# EAGLE board MAIN_V093r3 (EAGLE 5.11), part 1 of 2
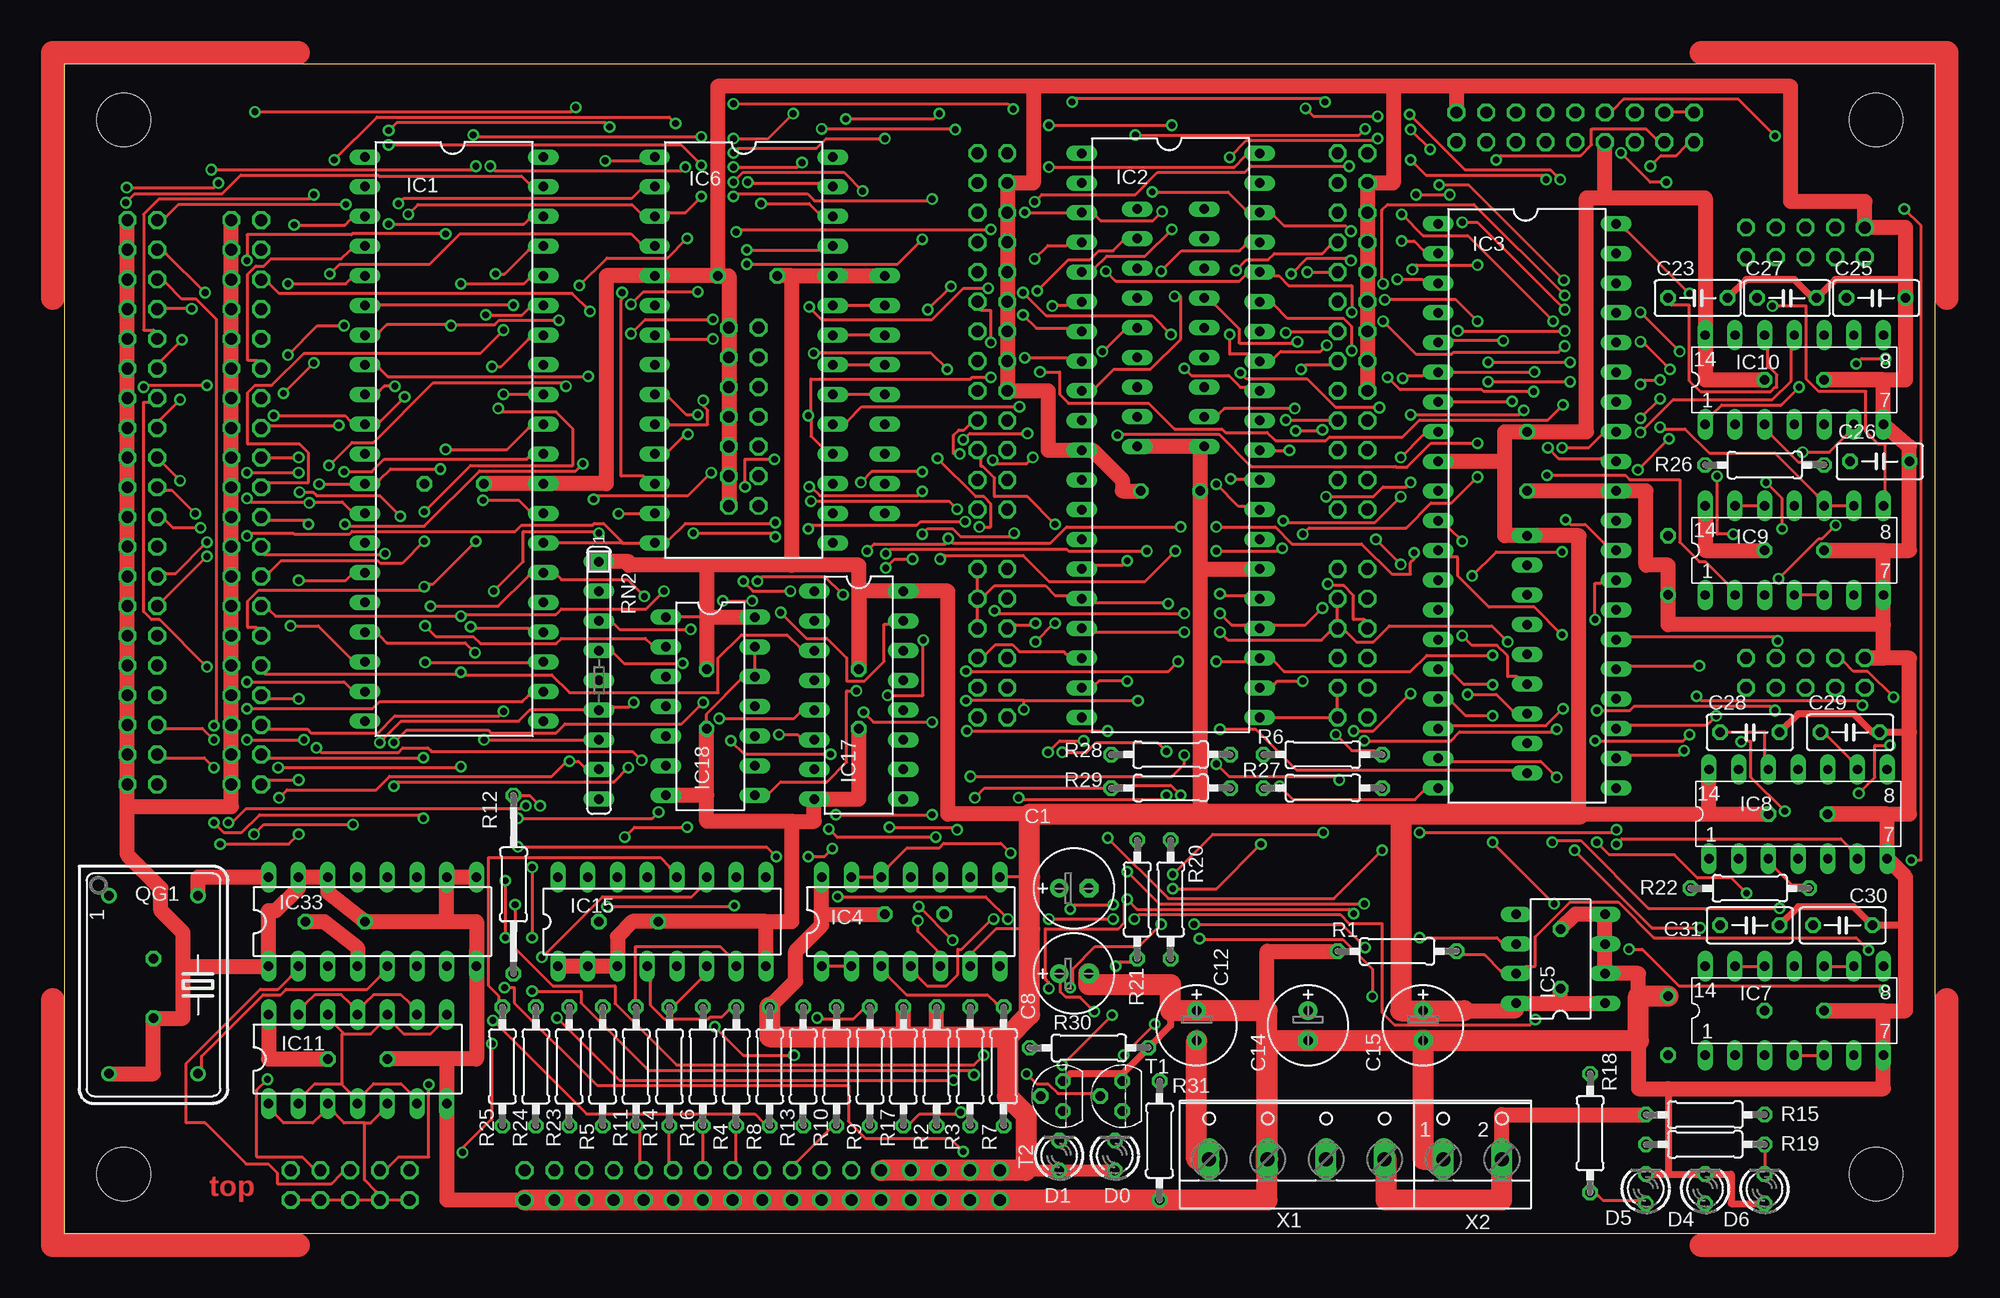
[diagram p4: board, top side]
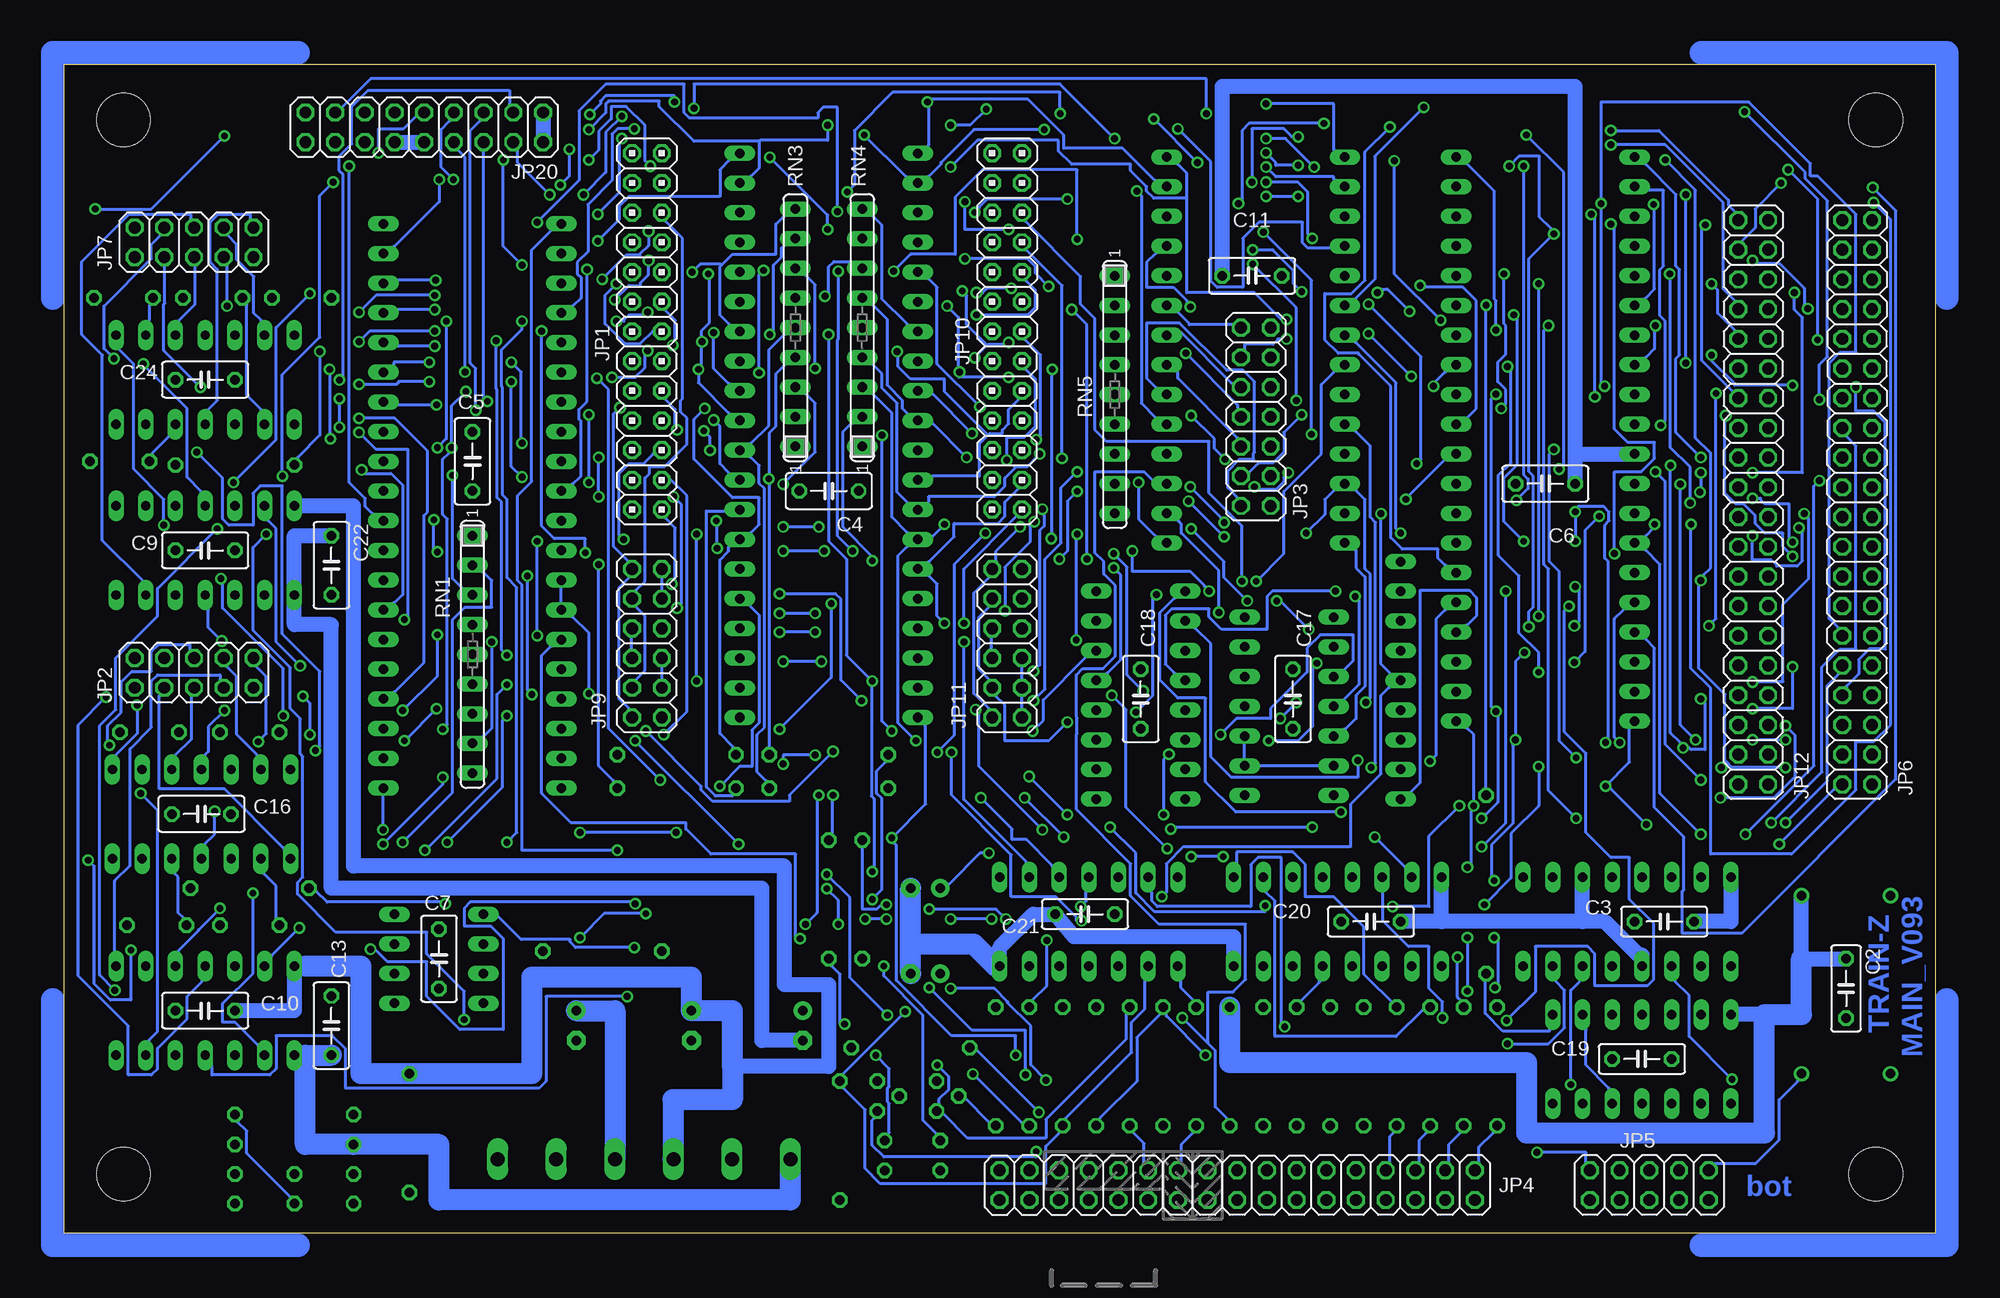
[diagram p5: board, bottom side, seen from below]

Size 160 x 100 mm. Coordinates in mm from the lower left corner, seen from the top.
Outline: 0,0 160,0 160,100 0,100 0,0
Copper layers (1*16): Top 0.035mm / dielectric 1.5mm / Bottom 0.035mm
Design rules "qprint_1": minimum track width 10mil, minimum drill 23mil, track to track 8mil, track to pad 8mil, pad to pad 8mil, via to via 8mil, smd to smd 8mil, copper to edge 40mil, drill to drill 8mil, minimum pad ring 10mil, minimum via ring 8mil, stop-mask expansion 4mil, vias tented up to drill 24mil, thermal gap 10mil
Net classes: 0 default: width 0.254 mm, clearance 0.203 mm; 1 +5V: width 1.016 mm, clearance 0.203 mm; 2 +12V: width 1.016 mm, clearance 0.203 mm; 3 -12V: width 1.016 mm, clearance 0.203 mm; 4 GND: width 1.27 mm, clearance 0.203 mm
Holes 4.57 mm at 5.08,95.25 5.08,5.08 154.94,5.08 154.94,95.25
tRestrict: area 0.3,90.8 to 10.2,99.7; area 149.9,90.8 to 159.7,99.7; area 149.9,0.3 to 159.7,9.2; area 0.3,0.3 to 10.2,9.2; 4 lines
bRestrict: area 0.3,90.8 to 10.2,99.7; area 149.9,90.8 to 159.7,99.7; area 149.9,0.3 to 159.7,9.2; area 0.3,0.3 to 10.2,9.2; 4 lines

## Footprints (pad centres in the part's own frame; a part is rotated, then mirrored left to right if it is on the bottom)
E2,5-7 = drill 0.813 pad 1.6 round: + -1.27,0 | drill 0.813 pad 1.6 octagon: - 1.27,0
C050-025X075 = drill 0.813 octagon: 1 -2.54,0; 2 2.54,0
C050-030X075 = drill 0.813 octagon: 1 -2.54,0; 2 2.54,0
LED3MM = drill 0.813 octagon: A -1.27,0; K 1.27,0
DIL40 = drill 0.813 long: 1 -24.13,-7.62; 2 -21.59,-7.62; 3 -19.05,-7.62; 4 -16.51,-7.62; 5 -13.97,-7.62; 6 -11.43,-7.62; 7 -8.89,-7.62; 8 -6.35,-7.62; 9 -3.81,-7.62; 10 -1.27,-7.62; 11 1.27,-7.62; 12 3.81,-7.62; 13 6.35,-7.62; 14 8.89,-7.62; 15 11.43,-7.62; 16 13.97,-7.62; 17 16.51,-7.62; 18 19.05,-7.62; 19 21.59,-7.62; 20 24.13,-7.62; 21 24.13,7.62; 22 21.59,7.62; 23 19.05,7.62; 24 16.51,7.62; 25 13.97,7.62; 26 11.43,7.62; 27 8.89,7.62; 28 6.35,7.62; 29 3.81,7.62; 30 1.27,7.62; 31 -1.27,7.62; 32 -3.81,7.62; 33 -6.35,7.62; 34 -8.89,7.62; 35 -11.43,7.62; 36 -13.97,7.62; 37 -16.51,7.62; 38 -19.05,7.62; 39 -21.59,7.62; 40 -24.13,7.62
DIL14 = drill 0.813 long: 1 -7.62,-3.81; 2 -5.08,-3.81; 3 -2.54,-3.81; 4 0,-3.81; 5 2.54,-3.81; 6 5.08,-3.81; 7 7.62,-3.81; 8 7.62,3.81; 9 5.08,3.81; 10 2.54,3.81; 11 0,3.81; 12 -2.54,3.81; 13 -5.08,3.81; 14 -7.62,3.81
DIL8 = drill 0.813 long: 1 -3.81,-3.81; 2 -1.27,-3.81; 3 1.27,-3.81; 4 3.81,-3.81; 5 3.81,3.81; 6 1.27,3.81; 7 -1.27,3.81; 8 -3.81,3.81
DIL28 = drill 0.813 long: 1 -16.51,-7.62; 2 -13.97,-7.62; 3 -11.43,-7.62; 4 -8.89,-7.62; 5 -6.35,-7.62; 6 -3.81,-7.62; 7 -1.27,-7.62; 8 1.27,-7.62; 9 3.81,-7.62; 10 6.35,-7.62; 11 8.89,-7.62; 12 11.43,-7.62; 13 13.97,-7.62; 14 16.51,-7.62; 15 16.51,7.62; 16 13.97,7.62; 17 11.43,7.62; 18 8.89,7.62; 19 6.35,7.62; 20 3.81,7.62; 21 1.27,7.62; 22 -1.27,7.62; 23 -3.81,7.62; 24 -6.35,7.62; 25 -8.89,7.62; 26 -11.43,7.62; 27 -13.97,7.62; 28 -16.51,7.62
DIL14' = drill 0.8 long: 1 -7.62,-3.81; 2 -5.08,-3.81; 3 -2.54,-3.81; 4 0,-3.81; 5 2.54,-3.81; 6 5.08,-3.81; 7 7.62,-3.81; 8 7.62,3.81; 9 5.08,3.81; 10 2.54,3.81; 11 0,3.81; 12 -2.54,3.81; 13 -5.08,3.81; 14 -7.62,3.81
DIL16 = drill 0.813 long: 1 -8.89,-3.81; 2 -6.35,-3.81; 3 -3.81,-3.81; 4 -1.27,-3.81; 5 1.27,-3.81; 6 3.81,-3.81; 7 6.35,-3.81; 8 8.89,-3.81; 9 8.89,3.81; 10 6.35,3.81; 11 3.81,3.81; 12 1.27,3.81; 13 -1.27,3.81; 14 -3.81,3.81; 15 -6.35,3.81; 16 -8.89,3.81
2X13 = drill 1.016 octagon: 1 -15.24,-1.27; 2 -15.24,1.27; 3 -12.7,-1.27; 4 -12.7,1.27; 5 -10.16,-1.27; 6 -10.16,1.27; 7 -7.62,-1.27; 8 -7.62,1.27; 9 -5.08,-1.27; 10 -5.08,1.27; 11 -2.54,-1.27; 12 -2.54,1.27; 13 0,-1.27; 14 0,1.27; 15 2.54,-1.27; 16 2.54,1.27; 17 5.08,-1.27; 18 5.08,1.27; 19 7.62,-1.27; 20 7.62,1.27; 21 10.16,-1.27; 22 10.16,1.27; 23 12.7,-1.27; 24 12.7,1.27; 25 15.24,-1.27; 26 15.24,1.27
2X05 = drill 1.016 octagon: 1 -5.08,-1.27; 2 -5.08,1.27; 3 -2.54,-1.27; 4 -2.54,1.27; 5 0,-1.27; 6 0,1.27; 7 2.54,-1.27; 8 2.54,1.27; 9 5.08,-1.27; 10 5.08,1.27
2X07 = drill 1.016 octagon: 1 -7.62,-1.27; 2 -7.62,1.27; 3 -5.08,-1.27; 4 -5.08,1.27; 5 -2.54,-1.27; 6 -2.54,1.27; 7 0,-1.27; 8 0,1.27; 9 2.54,-1.27; 10 2.54,1.27; 11 5.08,-1.27; 12 5.08,1.27; 13 7.62,-1.27; 14 7.62,1.27
2X17 = drill 1.016 octagon: 1 -20.32,-1.27; 2 -20.32,1.27; 3 -17.78,-1.27; 4 -17.78,1.27; 5 -15.24,-1.27; 6 -15.24,1.27; 7 -12.7,-1.27; 8 -12.7,1.27; 9 -10.16,-1.27; 10 -10.16,1.27; 11 -7.62,-1.27; 12 -7.62,1.27; 13 -5.08,-1.27; 14 -5.08,1.27; 15 -2.54,-1.27; 16 -2.54,1.27; 17 0,-1.27; 18 0,1.27; 19 2.54,-1.27; 20 2.54,1.27; 21 5.08,-1.27; 22 5.08,1.27; 23 7.62,-1.27; 24 7.62,1.27; 25 10.16,-1.27; 26 10.16,1.27; 27 12.7,-1.27; 28 12.7,1.27; 29 15.24,-1.27; 30 15.24,1.27; 31 17.78,-1.27; 32 17.78,1.27; 33 20.32,-1.27; 34 20.32,1.27
2X20 = drill 1.016 octagon: 1 -24.13,-1.27; 2 -24.13,1.27; 3 -21.59,-1.27; 4 -21.59,1.27; 5 -19.05,-1.27; 6 -19.05,1.27; 7 -16.51,-1.27; 8 -16.51,1.27; 9 -13.97,-1.27; 10 -13.97,1.27; 11 -11.43,-1.27; 12 -11.43,1.27; 13 -8.89,-1.27; 14 -8.89,1.27; 15 -6.35,-1.27; 16 -6.35,1.27; 17 -3.81,-1.27; 18 -3.81,1.27; 19 -1.27,-1.27; 20 -1.27,1.27; 21 1.27,-1.27; 22 1.27,1.27; 23 3.81,-1.27; 24 3.81,1.27; 25 6.35,-1.27; 26 6.35,1.27; 27 8.89,-1.27; 28 8.89,1.27; 29 11.43,-1.27; 30 11.43,1.27; 31 13.97,-1.27; 32 13.97,1.27; 33 16.51,-1.27; 34 16.51,1.27; 35 19.05,-1.27; 36 19.05,1.27; 37 21.59,-1.27; 38 21.59,1.27; 39 24.13,-1.27; 40 24.13,1.27
2X06 = drill 1.016 octagon: 1 -6.35,-1.27; 2 -6.35,1.27; 3 -3.81,-1.27; 4 -3.81,1.27; 5 -1.27,-1.27; 6 -1.27,1.27; 7 1.27,-1.27; 8 1.27,1.27; 9 3.81,-1.27; 10 3.81,1.27; 11 6.35,-1.27; 12 6.35,1.27
2X09 = drill 1.016 octagon: 1 -10.16,-1.27; 2 -10.16,1.27; 3 -7.62,-1.27; 4 -7.62,1.27; 5 -5.08,-1.27; 6 -5.08,1.27; 7 -2.54,-1.27; 8 -2.54,1.27; 9 0,-1.27; 10 0,1.27; 11 2.54,-1.27; 12 2.54,1.27; 13 5.08,-1.27; 14 5.08,1.27; 15 7.62,-1.27; 16 7.62,1.27; 17 10.16,-1.27; 18 10.16,1.27
DIL14S = drill 0.813 round: 1 -7.62,-3.81; 7 7.62,-3.81; 8 7.62,3.81; 14 -7.62,3.81
0207/10 = drill 0.813 octagon: 1 -5.08,0; 2 5.08,0
0207/15 = drill 0.813 octagon: 1 -7.62,0; 2 7.62,0
SIL9 = drill 0.813 long: 1 -10.16,0; 2 -7.62,0; 3 -5.08,0; 4 -2.54,0; 5 0,0; 6 2.54,0; 7 5.08,0; 8 7.62,0; 9 10.16,0
TO92 = drill 0.813 octagon: 1 1.27,0; 2 0,1.905; 3 -1.27,0
W237-4 = drill 1.194 long: 1 -7.5,-1.27; 2 -2.5,-1.27; 3 2.5,-1.27; 4 7.5,-1.27
W237-102 = drill 1.194 long: 1 -2.5,-1.27; 2 2.5,-1.27

## Placement (x,y rotation side)
C1  10µ/10V  [E2,5-7]  86.36,29.53 0 top
C2  100n  [C050-025X075]  7.62,20.95 270 bottom
C3  100n  [C050-025X075]  23.18,26.67 180 bottom
C4  100n  [C050-030X075]  94.61,63.5 180 bottom
C5  100n  [C050-030X075]  125.09,66.04 270 bottom
C6  100n  [C050-030X075]  33.34,64.14 0 bottom
C7  100n  [C050-030X075]  127.95,23.5 90 bottom
C8  100µ/10V  [E2,5-7]  86.36,22.23 0 top
C9  100n  [C050-030X075]  147.96,58.42 180 bottom
C10  100n  [C050-030X075]  147.96,19.05 180 bottom
C11  100n  [C050-030X075]  58.42,81.92 0 bottom
C12  100µ/25V  [E2,5-7]  96.84,17.78 270 top
C13  100n  [C050-030X075]  137.16,17.78 90 bottom
C14  100µ/25V  [E2,5-7]  106.36,17.78 270 top
C15  100µ/25V  [E2,5-7]  116.2,17.78 270 top
C16  100n  [C050-030X075]  148.27,35.88 180 bottom
C17  100n  [C050-030X075]  54.93,45.72 270 bottom
C18  100n  [C050-030X075]  67.94,45.72 270 bottom
C19  100n  [C050-025X075]  25.08,14.92 180 bottom
C20  100n  [C050-025X075]  48.26,26.67 180 bottom
C21  100n  [C050-025X075]  72.71,27.3 180 bottom
C22  100n  [C050-030X075]  137.16,57.15 270 bottom
C23  470p  [C050-030X075]  139.7,80.01 0 top
C24  100n  [C050-030X075]  147.96,73.03 180 bottom
C25  470p  [C050-030X075]  154.94,80.01 0 top
C26  470p  [C050-030X075]  155.26,66.04 0 top
C27  470p  [C050-030X075]  147.32,80.01 0 top
C28  470p  [C050-030X075]  144.15,42.86 0 top
C29  470p  [C050-030X075]  152.72,42.86 0 top
C30  470p  [C050-030X075]  152.08,26.35 0 top
C31  470p  [C050-030X075]  144.15,26.35 0 top
D0  [LED3MM]  89.85,6.67 90 top
D1  [LED3MM]  85.09,6.67 90 top
D4  [LED3MM]  140.34,3.81 90 top
D5  [LED3MM]  135.25,3.81 90 top
D6  [LED3MM]  145.41,3.81 90 top
IC1  Z80_CPU  [DIL40]  33.34,67.94 270 top
IC2  Z80_PIO  [DIL40]  94.61,68.26 270 top
IC3  Z80_SIO  [DIL40]  125.09,62.23 270 top
IC4  4093N  [DIL14]  72.39,26.67 0 top
IC5  24C08P  [DIL8]  127.95,23.5 90 top
IC6  Z80_CTC  [DIL28]  58.1,75.56 270 top
IC7  1488N  [DIL14']  147.96,19.05 0 top
IC8  1489N  [DIL14']  148.27,35.88 0 top
IC9  1488N  [DIL14']  147.96,58.42 0 top
IC10  1489N  [DIL14']  147.96,73.03 0 top
IC11  74LS04  [DIL14]  25.08,14.92 0 top
IC15  PCF8574P  [DIL16]  51.12,26.67 0 top
IC17  74LS138  [DIL16]  67.94,46.04 270 top
IC18  74LS00N  [DIL14]  55.24,45.09 270 top
IC33  74LS193  [DIL16]  26.35,26.67 0 top
JP1  PIO_B  [2X13]  110.17,77.15 90 bottom
JP2  SIO A  [2X05]  148.91,47.94 180 bottom
JP3  CTC_I/O  [2X07]  58.1,69.85 270 bottom
JP4  DSKY  [2X17]  59.69,4.13 180 bottom
JP5  CLK select  [2X05]  24.45,4.13 180 bottom
JP6  EXT_CTRL&DATA  [2X20]  6.67,62.55 90 bottom
JP7  SIO B  [2X05]  148.91,84.77 180 bottom
JP9  PIO_B_CONF  [2X06]  110.17,50.48 90 bottom
JP10  PIO_A  [2X13]  79.38,77.15 90 bottom
JP11  PIO_A_CONF  [2X06]  79.38,50.48 90 bottom
JP12  EXT_CTRL&ADDR  [2X20]  15.56,62.55 90 bottom
JP20  conf INT & SIO  [2X09]  129.22,94.61 180 bottom
QG1  10Mhz  [DIL14S]  7.62,21.27 270 top
R1  2k7  [0207/10]  113.98,24.13 0 top
R2  10k  [0207/10]  74.61,14.29 270 top
R3  2k7  [0207/10]  77.47,14.29 90 top
R4  160  [0207/10]  57.47,14.29 270 top
R5  160  [0207/10]  46.04,14.29 270 top
R6  160  [0207/10]  107.63,40.96 0 top
R7  2k7  [0207/10]  80.33,14.29 90 top
R8  160  [0207/10]  60.33,14.29 270 top
R9  160  [0207/10]  68.9,14.29 270 top
R10  160  [0207/10]  66.04,14.29 270 top
R11  160  [0207/10]  48.9,14.29 270 top
R12  22  [0207/15]  38.42,29.84 90 top
R13  160  [0207/10]  63.18,14.29 270 top
R14  160  [0207/10]  51.75,14.29 270 top
R15  160  [0207/10]  140.34,10.16 180 top
R16  160  [0207/10]  54.61,14.29 270 top
R17  10k  [0207/10]  71.75,14.29 270 top
R18  680  [0207/10]  130.49,8.57 90 top
R19  680  [0207/10]  140.34,7.62 180 top
R20  680  [0207/10]  94.61,28.57 270 top
R21  680  [0207/10]  91.76,28.57 270 top
R22  160  [0207/10]  144.15,29.53 180 top
R23  160  [0207/10]  43.18,14.29 270 top
R24  160  [0207/10]  40.32,14.29 270 top
R25  160  [0207/10]  37.47,14.29 270 top
R26  160  [0207/10]  145.41,65.72 180 top
R27  160  [0207/10]  107.63,38.1 0 top
R28  160  [0207/10]  94.61,40.96 180 top
R29  160  [0207/10]  94.61,38.1 180 top
R30  100k  [0207/10]  87.63,15.88 0 top
R31  100k  [0207/10]  93.66,7.94 270 top
RN1  8x10k  [SIL9]  125.09,49.53 270 bottom
RN2  8x10k  [SIL9]  45.72,47.31 270 top
RN3  8x10k  [SIL9]  97.47,77.47 90 bottom
RN4  8x10k  [SIL9]  91.76,77.47 90 bottom
RN5  8x10k  [SIL9]  70.17,71.75 270 bottom
T1  BC548C  [TO92]  90.49,11.75 90 top
T2  BC548C  [TO92]  85.41,11.75 90 top
U$1  [A4L-LOC]  -13.34,-52.7 0 top  (outside the outline)
X1  [W237-4]  105.41,7.62 0 top
X2  [W237-102]  120.43,7.62 0 top

## Tracks (layer width: path | path; a pad name or v marks a point on that pad's centre or on a via)
+5V
  Top 0.254: 54.93,52.7 IC18.1 | 82.55,30.48 IC4.8 | IC4.6 77.47,23.81 79.69,26.04 82.55,26.04
  Top 1.016: 82.23,5.4 D1.A D0.A
  Top 1.27: X2.2 122.93,10.16 R15.2 | 127.95,19.68 C7.1 | 127.95,19.68 IC5.8 124.14,19.05 119.7,19.05 | 140.65,35.88 C16.1 | 140.65,35.88 IC8.14 | 140.65,35.88 129.54,35.88 129.54,59.69 RN1.1 123.19,59.69 123.19,66.04 | 97.16,56.83 97.16,35.88 75.56,35.88 75.56,54.93 IC17.16 67.94,54.93 C18.1 67.94,57.15 | 97.16,56.83 C4.2 97.16,66.99 RN3.1 RN4.1 | 97.16,56.83 IC2.26 | 123.19,66.04 123.19,68.58 C5.1 130.18,68.58 130.18,88.58 131.76,88.58 | 123.19,66.04 IC3.9 | C24.1 140.34,73.03 IC10.14 140.34,88.58 131.76,88.58 | 62.23,81.92 C11.1 | 62.23,81.92 IC6.24 RN5.1 | 67.94,57.15 62.23,57.15 62.23,81.92 | IC33.16 11.43,30.48 QG1.14 | C3.1 22.23,26.67 25.08,24.45 IC33.4 | IC11.14 17.46,14.92 C19.1 | RN2.1 48.26,57.47 48.26,57.15 54.93,57.15 | 67.94,57.15 54.93,57.15 | 64.77,27.3 C21.1 | 64.77,27.3 IC4.14 | 64.77,27.3 64.77,26.35 62.55,24.13 62.55,21.59 R8.1 | 127.95,19.68 IC5.1 | 54.93,52.7 IC18.14 | 54.93,52.7 C17.1 | 54.93,57.15 54.93,52.7 | 71.75,16.83 R17.1 | 74.61,16.83 R2.1 | 131.76,88.58 JP20.12
  Top 1.778: 119.7,19.05 C15.+ 114.3,19.05 114.3,35.88 | X2.2 122.93,2.86 113.03,2.86 113.03,6.35 X1.4 | 114.3,35.88 129.54,35.88 | 114.3,35.88 97.16,35.88 82.55,35.88 82.55,30.48 82.55,26.04 82.55,18.73 80.64,16.83 | 80.64,16.83 80.64,11.75 82.23,10.16 82.23,5.4 JP4.33 JP4.31 JP4.29 JP4.27 JP4.25 | 80.64,16.83 74.61,16.83 71.75,16.83 60.33,16.83 R8.1
  Bottom 1.27: 30.8,66.67 IC1.11 | 30.16,26.67 42.23,26.67 | 42.23,26.67 IC15.16 | 42.23,26.67 C20.1 | C2.1 11.43,23.5 QG1.14 | C3.1 17.46,26.67 IC33.16 | 30.16,26.67 IC33.11 | 30.16,26.67 28.26,26.67 25.4,23.81 25.08,23.81 IC33.4 | 14.61,18.73 IC11.14 | 30.8,66.67 30.8,98.11 60.96,98.11 C11.1 | 30.8,66.67 C6.2 | JP20.12 JP20.10
  Bottom 1.778: X1.4 112.91,19.05 C15.+ | 11.43,23.5 11.43,18.73 14.61,18.73 14.61,8.57 34.92,8.57 34.92,14.61 60.33,14.61 R8.1
+12V
  Top 1.27: IC9.14 140.34,58.42 C9.1
  Bottom 1.27: 139.38,22.86 IC7.14 140.34,19.05 C10.1 | IC9.14 135.25,62.23 135.25,31.43 98.42,31.43 98.42,21.27 94.61,21.27 94.61,14.29 102.87,14.29
  Bottom 1.778: X1.3 107.95,6.35 107.95,11.43 102.87,11.43 102.87,14.29 102.87,19.05 C14.+ 106.36,21.91 120.02,21.91 120.02,13.65 R18.2 134.62,13.65 134.62,22.86 139.38,22.86
-12V
  Top 1.778: X1.1 96.84,6.35 C12.-
  Bottom 1.27: C13.1 IC7.1 | C22.1 140.34,59.69 IC9.1 140.34,52.07 137.16,52.07 137.16,29.53 100.33,29.53 100.33,16.51 C12.-
  Bottom 1.778: X1.1 97.91,2.86 127.95,2.86 127.95,7.62 R19.2 139.38,7.62 139.38,15.24 C13.1
/A5  (via drill 0.58)
  Top 0.254: v61.11,42.67 62.71,42.67 62.87,42.52 IC17.6
  Bottom 0.254: v61.11,42.67 59.74,44.04 56.84,44.04 56.84,44.88 53.72,48.01 53.72,50.06 52.58,51.21 49.76,51.21 49.76,49 50.52,48.23 IC18.3
/CPU_BUSAK  (via drill 0.58)
  Top 0.254: v30.86,48.84 39.7,48.84 IC1.23 | v28.73,61.34 26.98,63.09 21.57,63.09 21.26,63.4 v20.12,63.4 | v15.62,65.08 v20.04,65.08 | v12.04,80.47 8.69,83.82 JP6.38
  Bottom 0.254: v30.86,48.84 29.95,49.76 29.95,60.12 v28.73,61.34 | v20.12,63.4 20.04,63.48 v20.04,65.08 | v15.62,65.08 11.35,65.08 11.35,78.33 12.04,79.02 v12.04,80.47
/CPU_BUSREQ  (via drill 0.58)
  Top 0.254: RN2.8 44.42,39.93 43.97,40.39 v43.2,40.39 42.75,40.16 41.68,39.09 27.81,39.09 26.67,37.95 19.05,37.95 v18.36,37.26 | v12.8,43.43 13.03,43.43 13.03,78.18 11.28,79.93 10.06,79.93 8.69,81.31 JP6.36
  Bottom 0.254: v43.2,40.39 42.67,40.92 42.67,52.58 41.91,53.34 IC1.25 | v12.8,43.43 11.96,42.6 11.96,39.09 13.79,37.26 v18.36,37.26
/CPU_HALT  (via drill 0.58)
  Top 0.254: v19.36,51.97 21.72,51.97 24.46,49.23 IC1.18 | v18.75,71.86 v21.34,74.45 | v21.34,88.85 20.95,88.47 8.08,88.47 6.78,87.17 6.78,77.27 7.62,77.27 JP6.32
  Bottom 0.254: v19.36,51.97 18.75,52.58 v18.75,71.86 | v21.34,74.45 v21.34,88.85
/CPU_INT  (via drill 0.58)
  Top 0.254: v122.15,49.45 116.51,49.45 115.14,48.08 104.32,48.08 103.48,48.92 IC2.23 100.97,48.92 v98.53,48.92 | v123.06,76.35 118.72,76.35 IC3.5 | v26.98,41.99 28.8,43.81 38.86,43.81 39.85,44.81 44.42,44.81 RN2.6 47.02,45.03 48.31,45.03 v48.69,45.41 | v44.96,78.87 43.43,80.39 18.36,80.39 17.53,81.23 JP12.36 | v47.7,80.47 47.7,79.93 47.62,79.86 47.62,64.77 49.53,64.77 IC6.12 | v95.25,48.92 94.41,48.08 v77.11,48.08 | v76.35,61.95 75.67,62.64 v63.86,62.64 | v60.81,59.59 60.5,59.89 v53.8,59.89
  Bottom 0.254: v122.15,49.45 122.61,49.91 122.61,62.56 122.99,62.94 122.99,72.16 123.06,72.24 v123.06,76.35 | v26.98,41.99 27.43,42.44 27.43,52.58 26.67,53.34 IC1.16 | v48.69,45.41 48.31,45.8 48.31,56.39 48.77,56.84 48.77,62.79 49.53,63.55 IC6.12 51.44,63.55 52.2,62.79 52.2,61.49 v53.8,59.89 | v44.96,78.87 46.86,80.77 47.7,80.77 v47.7,80.47 | v95.25,48.92 v98.53,48.92 | v77.11,48.08 76.58,48.62 76.58,60.12 76.2,60.5 76.2,61.8 v76.35,61.95 | v60.81,59.59 v63.86,62.64
/CPU_IOREQ  (via drill 0.58)
  Top 0.254: v128.32,75.89 127.79,75.36 118.8,75.36 118.64,75.21 115.59,75.21 v112.78,78.03 | v110.11,78.79 110.11,81.08 104.7,81.08 103.86,81.92 103.48,81.92 IC2.36 100.97,81.92 100.51,81.46 89.92,81.46 v89.08,82.3 | v28.19,38.25 28.57,38.63 47.02,38.63 v48.23,39.85 | v16.23,34.14 17.07,34.98 v24.69,34.98 | v9.91,64.39 JP6.24 | v73.38,85.04 71.25,82.91 v58.37,82.91 | v54.63,71.25 54.63,70.79 55.02,70.41 55.02,69.19 51.74,69.19 IC6.10
  Bottom 0.254: v128.32,75.89 131.44,75.89 IC3.36 | v112.78,78.03 112.17,78.03 112.17,78.11 111.71,78.56 110.11,78.56 v110.11,78.79 | v48.23,39.85 47.85,40.23 47.85,60.81 48.31,61.27 48.31,67.36 49.53,68.58 IC6.10 | IC1.20 26.14,43.2 26.14,40.31 v28.19,38.25 27.74,38.02 v24.69,34.98 | v9.91,64.39 10.36,63.93 10.36,40.01 v16.23,34.14 | v89.08,82.3 87.63,83.74 83.82,83.74 83.82,88.62 81.46,90.98 73.38,90.98 v73.38,85.04 | v58.37,82.91 54.63,79.17 v54.63,71.25
/CPU_M1  (via drill 0.58)
  Top 0.254: 47.7,59.05 IC1.27 | 47.7,59.05 IC6.14 51.74,59.36 53.11,60.73 60.73,60.73 v60.81,60.81 | v114.3,66.37 116.2,68.28 IC3.8 | v114.3,63.02 112.09,60.81 104.39,60.81 v104.24,60.96 | v104.17,58.6 103.94,58.37 v98.53,58.37 | v95.02,58.37 92.43,55.78 84.2,55.78 81.99,57.99 75.21,57.99 v74.91,57.68 | v73.38,63.48 73,63.09 64.62,63.09 63.86,63.86 v63.7,63.86 | v11.66,60.35 9.3,60.35 8.69,60.96 JP6.20 | v15.62,59.66 15.85,59.89 19.58,59.89 19.66,59.82 24.38,59.82 24.61,60.05 38.56,60.05 39.09,60.58 45.19,60.58 45.34,60.73 46.1,60.73 47.7,59.13 47.7,59.05
  Bottom 0.254: IC18.5 50.44,43.13 49.53,44.04 49.53,46.02 48.77,46.79 48.77,56.16 49.53,56.92 49.53,58.45 IC6.14 | v114.3,63.02 v114.3,66.37 | v104.24,60.96 104.17,60.88 v104.17,58.6 | v95.02,58.37 v98.53,58.37 | v74.91,57.68 74.22,58.37 74.22,62.64 v73.38,63.48 | v63.7,63.86 60.81,60.96 v60.81,60.81 | v11.66,60.35 11.35,60.05 11.35,57.53 11.81,57.07 13.56,57.07 13.56,57.15 14.02,57.61 15.62,57.61 v15.62,59.66
/CPU_MREQ  (via drill 0.58)
  Top 0.254: v15.62,47.17 23.93,47.17 24.46,46.63 IC1.19 | v11.2,61.57 9.22,63.55 8.69,63.55 JP6.22
  Bottom 0.254: v15.62,47.17 13.03,47.17 13.03,53.8 10.82,56.01 10.82,61.19 v11.2,61.57
/CPU_NMI  (via drill 0.58)
  Top 0.254: v35.13,49.68 34.29,50.52 27.58,50.52 26.98,51.13 IC1.17 | v35.89,42.22 44.42,42.22 RN2.7 | v76.89,7.01 75.74,8.15 68.5,8.15 67.06,9.6 67.06,12.65 45.57,12.65 38.48,19.74 38.48,21.03 v37.64,21.03 | v37.72,30.18 v37.72,25.3 | v13.18,89.84 12.8,89.46 v5.33,89.46
  Bottom 0.254: v35.13,49.68 35.89,48.92 v35.89,42.22 36.12,41.76 36.12,35.05 37.95,33.22 37.95,30.4 v37.72,30.18 | v76.89,7.01 76.89,6.55 89.92,6.55 90.91,7.54 90.91,9.68 90.75,9.83 T1.3 | v37.64,21.03 37.41,21.26 37.41,24.99 v37.72,25.3 | v13.18,89.84 15.39,87.63 15.39,86.03 16.54,84.89 JP12.38 | v5.33,89.46 3.35,87.48 3.35,38.86 16.54,25.68 21.64,25.68 21.64,29.26 21.49,29.41 21.49,33.91 24,36.42 24,50.06 24.77,50.83 IC1.17
/CPU_RD  (via drill 0.58)
  Top 0.254: v110.11,75.51 110.11,77.57 109.42,78.26 104.62,78.26 103.48,79.4 IC2.35 | v113.16,73.23 114.22,72.16 121.23,72.16 121.39,72.01 v125.65,72.01 | v126.87,67.21 127.79,66.29 131.44,66.29 IC3.32 | v39.47,36.58 39.24,36.35 15.54,36.35 14.33,35.13 v14.02,35.13 | v43.74,96.32 43.36,95.94 v16.31,95.94 | v9.91,71.32 8.23,69.65 JP6.26 | v127.64,43.13 127.41,42.9 119.33,42.9 118.57,42.14 v111.18,42.14 | v102.34,33.3 98.53,29.49 v94.79,29.49 | v93.8,26.44 91.9,24.54 88.16,24.54 86.26,22.63 86.26,21.03 v86.03,21.03 | v77.8,13.56 77.42,13.95 49.99,13.95 44.2,19.74 44.2,20.73 v40.01,20.73 | v40.01,31.32 v40.01,25.3
  Bottom 0.254: v110.11,75.51 110.34,75.29 110.34,74.07 111.18,73.23 v113.16,73.23 | v125.65,72.01 126.87,70.79 v126.87,67.21 127.1,66.75 127.64,66.22 127.64,61.49 127.25,61.11 127.25,43.51 v127.64,43.13 | v14.02,35.13 9.68,39.47 9.68,48.46 8.15,49.99 6.78,49.99 6.78,67.36 7.62,68.2 JP6.26 | IC1.21 40.01,43.2 39.47,42.67 v39.47,36.58 39.7,36.12 39.7,31.62 v40.01,31.32 | v43.74,96.32 47.93,92.13 47.93,81.61 49.53,80.01 IC6.6 | v16.31,95.94 11.12,90.75 11.12,90.22 9.22,88.32 9.22,74.98 9.91,74.3 v9.91,71.32 | v102.34,33.3 v111.18,42.14 | v94.79,29.49 93.8,28.5 v93.8,26.44 | v86.03,21.03 82.37,17.37 77.8,17.37 v77.8,13.56 | v40.01,25.3 v40.01,20.73
/CPU_RFSH  (via drill 0.58)
  Top 0.254: v35.81,62.71 38.86,62.71 39.7,61.87 IC1.28 | v35.2,91.29 34.9,90.98 v12.57,90.98 | v10.06,76.43 8.31,74.68 JP6.30
  Bottom 0.254: v35.81,62.71 34.82,63.7 34.82,64.54 35.2,64.92 v35.2,91.29 | v12.57,90.98 10.06,88.47 v10.06,76.43
/CPU_WAIT  (via drill 0.58)
  Top 0.254: JP20.15 137.54,95.94 138.68,95.94 JP20.17 | v10.9,79.1 8.69,79.1 JP6.34 | v15.62,83.21 15.62,85.42 24.54,85.42 24.61,85.5 v32.61,85.5 | v34.75,51.89 34.9,51.74 39.7,51.74 IC1.24 | v62.33,95.78 60.2,93.65 v57.23,93.65 | v53.11,91.21 52.81,90.91 36.8,90.91 v36.42,91.29
  Bottom 0.254: IC1.24 40.01,52.05 39.24,52.81 39.24,54.41 39.85,55.02 44.04,55.02 44.04,38.56 44.81,37.8 RN2.9 | v10.9,79.1 11.2,79.4 11.2,80.85 13.34,82.98 15.62,82.98 v15.62,83.21 | v34.75,51.89 34.75,53.19 34.37,53.57 34.37,64.77 34.75,65.15 34.75,83.36 v32.61,85.5 32.84,85.95 33.83,86.94 33.83,92.13 35.59,92.13 v36.42,91.29 | v62.33,95.78 62.33,98.75 133.81,98.75 136.25,96.32 JP20.15 | v57.23,93.65 55.55,93.65 v53.11,91.21
/CPU_WR  (via drill 0.58)
  Top 0.254: v15.62,44.88 26.36,44.88 26.98,45.49 39.17,45.49 39.7,46.02 IC1.22 | v12.19,48.46 8.15,52.5 7.47,52.5 6.78,53.19 6.78,71.09 7.24,71.09 JP6.28
  Bottom 0.254: v15.62,44.88 12.19,44.88 v12.19,48.46
/CTC_CE  (via drill 0.58)
  Top 0.254: v61.27,53.11 63.48,50.9 65.23,50.9 66.9,49.23 66.9,47.24 68.43,47.24 70.1,48.92 70.1,52.12 70.48,52.12 IC17.15
  Bottom 0.254: v61.27,53.11 61.27,56.69 64.47,59.89 64.47,60.66 64.77,60.96 IC6.16
/EXT_MNI
  Top 0.254: R10.2 65.46,8.91 62.64,6.1 62.56,6.1 JP4.19
/EXT_RESET
  Bottom 0.254: R13.2 63.48,8.61 64.47,7.62 64.47,6.1 JP4.21
/PIO_A_ACK  (via drill 0.58)
  Top 0.254: v74.68,66.29 77.95,63.02 78.64,63.02 79.25,62.41 79.25,60.43 v78.26,60.43
  Bottom 0.254: JP11.2 80.92,44.88 82.22,46.18 82.22,54.79 80.92,56.08 JP11.12 80.31,57.53 80.31,58.37 v78.26,60.43 | v74.68,66.29 74.68,81.08 77.72,84.12 JP10.19
/PIO_A_STB_FROM_PER  (via drill 0.58)
  Top 0.254: JP11.7 JP11.9 | JP11.9 JP11.11 | v98.83,43.13 101.88,43.13 105.39,39.62 123.83,39.62 RN1.9 | v94.41,53.87 94.34,53.95 88.24,53.95 IC2.16 85.72,54.56 84.73,54.56 83.9,55.4 79.55,55.4 78.79,54.63 JP11.9
  Bottom 0.254: v98.83,43.13 94.41,47.55 v94.41,53.87
/PIO_A_STRB  (via drill 0.58)
  Top 0.254: v83.06,52.2 82.91,52.05 81.38,52.05 JP11.8
  Bottom 0.254: JP11.6 80.7,49.91 80.7,51.05 JP11.8 | v83.06,52.2 83.06,56.84 78.56,61.34 JP10.1
/PIO_B_ACK  (via drill 0.58)
  Top 0.254: v100.2,82.37 101.12,83.29 102.95,83.29 103.48,83.82 107.59,83.82 108.2,84.43 JP1.19 | v100.58,73.61 101.12,73.08 106.3,73.08 108.74,70.64 v112.47,70.64
  Bottom 0.254: JP9.2 111.71,44.88 112.55,45.72 112.55,55.24 111.71,56.08 JP9.12 111.78,57.53 113,58.75 113,70.1 v112.47,70.64 | v100.2,82.37 100.58,81.99 v100.58,73.61
/PIO_B_STB_FROM_PER  (via drill 0.58)
  Top 0.254: v95.78,51.44 88.24,51.44 IC2.17 | v98.83,51.44 99.52,50.75 107.52,50.75 108.2,51.44 JP9.7 | v123.44,50.6 122.07,51.97 113.31,51.97 111.94,50.6 110.49,50.6 109.65,51.44 JP9.7 | JP9.9 108.89,53.57 108.89,52.5 JP9.7
  Bottom 0.254: JP9.9 108.89,55.02 108.89,56.08 JP9.11 | v95.78,51.44 v98.83,51.44 | v123.44,50.6 123.44,43.2 124.13,42.52 RN1.8
/PIO_B_STRB  (via drill 0.58)
  Top 0.254: v108.05,55.55 108.2,55.4 109.42,55.4 110.26,54.56 110.26,52.5 111.18,52.5 JP9.8
  Bottom 0.254: JP9.6 111.48,49.91 111.48,51.05 JP9.8 | v108.05,55.55 107.75,55.85 107.75,60.35 108.58,61.19 JP1.1
/PIO_CE  (via drill 0.58)
  Top 0.254: v70.26,56.92 71.02,57.68 v72.54,57.68 | v73.84,79.02 v75.82,81 | v82.98,83.36 84.12,84.51 85.72,84.51 IC2.4
  Bottom 0.254: v70.26,56.92 69.65,56.31 69.65,49.07 70.79,47.93 IC17.13 | v72.54,57.68 72.54,77.72 v73.84,79.02 | v75.82,81 76.96,82.14 76.96,82.68 77.65,83.36 v82.98,83.36
/PIO_M1  (via drill 0.58)
  Top 0.254: v67.74,46.41 66.9,46.41 66.9,40.31 65.23,38.63 61.27,38.63 60.35,37.72 IC18.8 | v70.26,58.14 70.64,58.52 85.72,58.52 85.88,58.37 v92.58,58.37 | v93.8,82.3 95.56,84.05 100.51,84.05 100.97,84.51 IC2.37
  Bottom 0.254: v67.74,46.41 69.11,47.78 69.11,57 v70.26,58.14 | v92.58,58.37 93.88,59.66 93.88,76.43 93.8,76.5 v93.8,82.3
/SIO_A_WAIT  (via drill 0.58)
  Top 0.254: v115.29,82.45 115.67,82.83 v120.85,82.83 | v122.45,91.82 122.83,92.2 129.69,92.2 130.61,93.12 130.61,94.49 135.25,94.49 136.09,93.65 JP20.16
  Bottom 0.254: v115.29,82.45 115.29,71.17 115.98,70.48 115.98,69.65 115.82,69.49 115.82,64.77 116.51,64.08 IC3.10 | v120.85,82.83 122.45,84.43 v122.45,91.82
/SIO_B_WAIT  (via drill 0.58)
  Top 0.254: v135.64,91.29 136.55,92.2 137.85,92.2 138.68,93.04 JP20.18
  Bottom 0.254: v135.64,91.29 135.64,64.24 134.26,62.87 134.26,62.18 133.66,61.57 IC3.30
/SIO_CE  (via drill 0.58)
  Top 0.254: v77.19,42.98 v89.23,42.98 | v90.07,68.28 90.14,68.35 98.75,68.35 101.5,65.61 113.84,65.61 113.92,65.53 114.83,65.53 116.89,67.59 v120.85,67.59 | v121.77,74.52 v128.78,74.52
  Bottom 0.254: v77.19,42.98 76.28,43.89 76.28,45.64 72.69,49.23 IC17.14 | v89.23,42.98 90.07,43.81 v90.07,68.28 | v120.85,67.59 120.93,67.67 120.93,73.69 v121.77,74.52 | v128.78,74.52 131.83,74.52 131.83,74.3 IC3.35
/SYS_RESET  (via drill 0.58)
  Top 0.254: v49.61,54.48 48.16,55.93 42.52,55.93 42.22,56.24 IC1.26 39.7,56.24 37.11,53.65 v31.32,53.65 | v27.74,94.34 28.42,95.02 46.25,95.02 v46.63,94.64 | v64.39,18.44 64.47,18.36 67.51,18.36 68.28,19.13 R9.1 | v132.74,34.52 132.51,34.29 v115.9,34.29 | v107.67,34.29 107.52,34.14 98.22,34.14 v94.79,30.71 | v85.34,14.4 v89.61,18.67 | v36.65,18.21 44.65,10.21 59.05,10.21 59.74,9.53 R8.2
  Bottom 0.254: v49.61,54.48 49.3,54.18 49.3,46.94 50.52,45.72 IC18.4 | v27.74,94.34 23.62,94.34 17.68,88.39 17.68,87.94 17.14,87.4 JP12.40 | v46.63,94.64 48.77,92.51 48.77,81.53 49.91,80.39 52.2,80.39 52.2,76.43 51.05,75.29 49.3,75.29 49.3,75.21 46.56,72.47 46.56,59.51 45.57,58.52 42.52,58.52 42.52,57.76 41.91,57.15 IC1.26 | 62.26,16.31 v64.39,18.44 | 62.26,16.31 61.57,15.62 61.57,10.82 60.58,9.83 R8.2 | R9.1 69.19,18.75 69.19,16.61 76.05,9.75 76.05,8.15 82.75,8.15 84.81,10.21 T2.3 85.19,11.12 85.19,11.51 84.35,12.34 84.35,13.41 v85.34,14.4 | v132.74,34.52 132.74,37.49 IC3.21 | v107.67,34.29 v115.9,34.29 | v94.79,30.71 92.81,28.73 92.81,21.87 v89.61,18.67 | IC6.17 66.98,64.47 67.67,65.15 71.86,65.15 71.86,58.22 71.09,57.45 71.09,56.39 70.1,55.4 70.1,49.38 71.17,48.31 72.92,48.31 73.46,47.78 73.46,44.2 73.38,44.12 73.38,42.75 73.46,42.67 73.46,36.27 68.81,31.62 68.81,28.88 66.37,26.44 58.98,26.44 58.98,21.72 60.05,20.65 62.18,20.65 62.18,16.38 62.26,16.31 | v31.32,53.65 31.7,53.26 31.7,42.9 29.87,41.07 29.87,34.29 27.74,32.16 26.14,32.16 26.14,28.57 24.08,26.52 24.08,21.72 24.61,21.18 29.11,21.18 29.11,23.93 29.72,24.54 34.21,24.54 34.21,20.65 v36.65,18.21
A0  (via drill 0.58)
  Top 0.254: v23.93,65.15 26.29,65.15 27.36,66.22 39.55,66.22 39.7,66.37 IC1.30 | v20.04,38.79 17.53,38.79 JP12.2 | 63.86,69.95 63.86,73.08 77.5,73.08 77.65,73.23 v79.25,73.23 | 63.86,69.95 63.86,68.2 64.77,67.28 IC6.18 | v84.51,79.32 84.58,79.4 85.72,79.4 IC2.6 | v128.17,70.87 126.87,69.57 115.9,69.57 114.45,68.12 108.2,68.12 107.9,67.82 103.56,67.82 102.87,68.5 99.29,68.5 98.98,68.81 94.94,68.81 92.73,71.02 85.88,71.02 85.11,71.78 85.11,73.69 v83.44,73.69 | v45.26,62.79 45.57,63.09 53.34,63.09 v55.32,65.08 | v58.22,63.86 58.22,66.22 v60.73,66.22 | v63.63,69.95 63.86,69.95
  Bottom 0.254: v23.93,65.15 23.09,64.31 23.09,41.83 v20.04,38.79 | v79.25,73.23 83.52,73.23 83.52,73.69 | 83.52,73.69 83.52,78.33 v84.51,79.32 | v128.17,70.87 131.44,70.87 IC3.34 | 83.52,73.69 v83.44,73.69 | v45.26,62.79 45.26,62.87 41.99,66.14 IC1.30 | v55.32,65.08 55.7,64.69 55.7,64.31 56.39,63.63 58.22,63.63 v58.22,63.86 | v60.73,66.22 61.65,67.13 61.65,67.97 v63.63,69.95
A1  (via drill 0.58)
  Top 0.254: v32.61,67.06 37.87,67.06 39.7,68.89 IC1.31 | v30.71,40.69 17.53,40.69 JP12.4 | v81.69,70.71 68.2,70.71 66.98,69.49 IC6.19 | v128.09,67.21 130.38,67.21 131.44,68.28 IC3.33 | v127.33,78.03 120.02,85.34 116.2,85.34 v114.38,87.17 | v112.32,93.65 112.17,93.5 101.12,93.5 v99.67,92.05 | v94.72,85.88 92.43,83.59 89.15,83.59 88.16,82.6 IC2.5 | v44.04,81.08 46.41,83.44 51.59,83.44 v53.26,85.11 | v57.23,89.92 58.06,90.75 66.67,90.75 v68.28,89.15
  Bottom 0.254: v32.61,67.06 32.99,66.67 32.99,57.45 32.16,56.62 32.16,42.14 v30.71,40.69 | v81.69,70.71 85.34,74.37 85.34,80.92 86.03,81.61 IC2.5 | v128.09,67.21 127.33,67.97 v127.33,78.03 | v114.38,87.17 112.55,89 112.55,93.42 v112.32,93.65 | v99.67,92.05 94.72,87.1 v94.72,85.88 | v44.04,81.08 44.04,80.92 40.39,80.92 39.24,79.78 39.24,70.56 40.01,69.8 IC1.31 | v53.26,85.11 53.65,85.5 53.65,89.08 54.48,89.92 v57.23,89.92 | v68.28,89.15 67.89,88.77 67.89,71.02 66.67,69.8 IC6.19
A2  (via drill 0.58)
  Top 0.254: v37.57,71.78 39.7,71.78 IC1.32 | v37.57,44.65 37.19,44.27 28.27,44.27 26.82,42.82 21.11,42.82 20.8,43.13 17.53,43.13 JP12.6 | v50.83,36.04 50.29,35.51 v38.79,35.51
  Bottom 0.254: v37.57,71.78 37.95,71.4 37.95,45.03 v37.57,44.65 37.41,44.2 37.41,36.88 v38.79,35.51 | v50.83,36.04 59.82,36.04 62.41,38.63 62.41,45.8 64.77,45.8 66.29,47.32 66.29,53.11 65.08,54.33 IC17.1
A3  (via drill 0.58)
  Top 0.254: v49.38,40.46 48.62,41.22 31.39,41.22 31.09,41.53 28.96,41.53 28.57,41.15 21.95,41.15 v21.57,41.53 | v20.04,45.72 17.53,45.72 JP12.8 | v42.9,72.47 42.6,72.77 31.55,72.77 26.44,67.67 24.61,67.67 v22.63,65.68
  Bottom 0.254: v49.38,40.46 49.38,39.01 60.2,39.01 61.95,40.77 61.95,50.44 63.25,51.74 IC17.2 | v20.04,45.72 19.66,45.34 19.66,41.38 20.88,41.38 21.03,41.53 v21.57,41.53 21.79,41.99 22.63,42.82 v22.63,65.68 | v42.9,72.47 42.9,72.69 41.91,73.69 IC1.33
A4  (via drill 0.58)
  Top 0.254: v36.58,74.14 37.34,74.14 39.7,76.5 IC1.34 | JP12.10 17.14,47.85 33.76,47.85 v33.91,48.01 34.37,47.78 41.68,47.78 43.2,46.25 55.93,46.25 55.93,49.23 57.91,51.21 61.8,51.21 62.87,50.14 IC17.3
  Bottom 0.254: v36.58,74.14 36.27,73.84 36.27,65.91 37.34,64.85 37.34,57.99 35.59,56.24 35.59,51.36 33.91,49.68 v33.91,48.01
A5  (via drill 0.58)
  Top 0.254: v30.86,51.97 31.77,51.05 34.98,51.05 35.59,50.44 42.06,50.44 42.52,50.9 49.68,50.9 50.14,50.44 IC18.2 | JP12.12 16.46,51.82 15.7,51.82 15.7,54.1 16.61,55.02 30.48,55.02 v30.79,55.32 31.24,55.55 31.55,55.55 v35.2,59.21 | v36.04,78.56 39.17,78.56 39.7,79.1 IC1.35
  Bottom 0.254: v30.86,51.97 30.48,52.35 30.48,55.02 v30.79,55.32 | v36.04,78.56 35.74,78.26 35.74,65.76 36.88,64.62 36.88,60.88 v35.2,59.21
A6  (via drill 0.58)
  Top 0.254: v33.91,81.23 39.32,81.23 39.7,81.61 IC1.36 | JP12.14 17.53,53.34 18.06,52.81 v33.91,52.81 34.37,52.96 42.06,52.96 42.52,53.42 49.76,53.42 v51.28,54.94
  Bottom 0.254: v33.91,52.81 v33.91,81.23 | v51.28,54.94 56.69,54.94 57.15,54.48 57.15,51.66 61.04,51.66 62.1,52.73 62.1,53.42 65.3,53.42 65.84,52.88 65.84,48.69 65.08,47.93 IC17.4
A7  (via drill 0.58)
  Top 0.254: v36.88,82.07 37.64,82.07 39.7,84.12 IC1.37 | v37.11,70.56 37.41,70.26 42.06,70.26 43.51,68.81 43.51,65.68 34.75,65.68 v30.79,61.72 | v30.79,59.21 28.88,57.3 27.05,57.3 26.82,57.53 18.52,57.53 17.53,56.54 JP12.16 | v56.01,44.04 62.41,44.04 62.87,44.5 IC17.5 | v54.63,45.41 52.81,43.59 42.82,43.59 42.06,42.82 36.5,42.82 36.27,43.05 29.26,43.05 v28.19,41.99
  Bottom 0.254: v36.88,82.07 36.88,77.8 36.73,77.65 36.73,75.21 37.41,74.52 37.41,72.85 36.73,72.16 36.73,70.94 v37.11,70.56 | v30.79,59.21 v30.79,61.72 30.56,62.18 28.35,62.18 27.89,61.72 27.89,60.96 28.27,60.58 28.27,57.76 27.96,57.45 27.96,42.22 v28.19,41.99 | v54.63,45.41 v56.01,44.04
A8  (via drill 0.58)
  Top 0.254: v27.74,86.33 39.32,86.33 39.7,86.72 IC1.38 | v27.43,58.14 27.36,58.06 17.22,58.06 JP12.18
  Bottom 0.254: v27.74,86.33 27.43,86.03 27.43,68.81 26.29,67.67 24,67.67 24,66.29 25.15,65.15 27.43,65.15 v27.43,58.14
A9  (via drill 0.58)
  Top 0.254: v5.26,88.16 6.02,88.92 13.49,88.92 15.09,90.53 26.82,90.53 26.9,90.45 39.09,90.45 39.7,89.84 IC1.39 | v20.88,60.66 20.57,60.96 17.53,60.96 JP12.20
  Bottom 0.254: v5.26,88.16 3.81,86.72 3.81,43.51 5.26,42.06 6.78,42.06 6.78,37.95 12.27,32.46 19.2,32.46 19.2,46.63 20.88,48.31 v20.88,60.66
A10  (via drill 0.58)
  Top 0.254: v37.57,77.27 35.59,75.29 20.5,75.29 17.75,72.54 16.31,72.54 15.7,71.93 15.7,67.51 20.12,67.51 20.88,66.75 20.88,64.24 17.45,64.24 JP12.22
  Bottom 0.254: v37.57,77.27 37.57,79.78 37.72,79.93 37.72,89.15 40.01,91.44 IC1.40
A11  (via drill 0.58)
  Top 0.254: v20.04,66.37 17.53,66.37 JP12.24
  Bottom 0.254: v20.04,66.37 22.17,68.5 22.17,74.83 21.87,75.13 21.87,82.45 22.17,82.75 22.17,88.85 24.77,91.44 IC1.1
A12  (via drill 0.58)
  Top 0.254: v23.47,69.11 17.53,69.11 JP12.26
  Bottom 0.254: v23.47,69.11 23.09,69.49 23.09,78.03 23.55,78.49 23.55,82.45 23.24,82.75 23.24,89.23 24.46,89.23 IC1.2
A13  (via drill 0.58)
  Top 0.254: v19.66,86.26 24,86.26 24.46,86.72 IC1.3
  Bottom 0.254: v19.66,86.26 19.96,85.95 19.96,74.68 17.3,72.01 JP12.28
A14
  Top 0.254: IC1.4 24.46,84.12 23.7,83.36 17.68,83.36 17.07,82.75 16.38,82.75 15.7,82.07 15.7,74.68 16.46,74.68 JP12.30
A15  (via drill 0.58)
  Top 0.254: v19.13,81.23 24.08,81.23 24.46,81.61 IC1.5
  Bottom 0.254: v19.13,81.23 18.59,80.7 18.59,78.72 17.14,77.27 JP12.32
CLK_DRV_OUT
  Top 0.254: 23.7,12.8 21.41,12.8 20.65,12.04 IC11.2 | 23.7,12.8 24.46,12.04 IC11.4 25.68,12.04 26.44,12.8 28.8,12.8 29.57,12.04 IC11.6 | 23.85,17.14 23.93,17.07 26.21,17.07 26.98,17.83 IC11.10 28.27,17.83 29.03,17.07 31.32,17.07 32.08,17.83 IC11.8 | 23.85,17.14 23.16,17.83 IC11.12 | 23.7,12.8 23.77,12.88 23.77,17.07 23.85,17.14
  Bottom 0.254: R12.1 38.48,21.64 38.48,18.82 36.96,17.3 32.99,17.3 32.99,17.45 IC11.8
CPU_CLK  (via drill 0.58)
  Top 0.254: v103.94,38.25 105.08,37.11 115.52,37.11 116.2,37.8 IC3.20 | v68.12,64.24 69.04,65.15 v73.38,65.15 | 82.07,45.57 v91.82,45.57 | 82.07,45.57 v77.11,45.57 | v98.83,54.71 98.98,54.56 100.97,54.56 IC2.25 | v38.41,79.4 26.98,79.4 IC1.6 | v24.08,88.01 9.75,88.01 8.69,86.94 JP6.40 | v76.35,34.52 76.12,34.75 v70.56,34.75 | v57.3,28.04 57.23,27.96 v46.41,27.96 | v40.69,36.58 39.85,37.41 39.01,37.41 R12.2 | v82.07,44.81 82.07,45.57
  Bottom 0.254: v103.94,38.25 102.26,39.93 101.19,39.93 101.19,43.05 100.58,43.66 100.58,52.88 101.35,53.65 IC2.25 | v68.12,64.24 68.12,61.11 66.67,59.66 IC6.15 | v73.38,65.15 74.75,63.78 74.75,59.05 76.12,57.68 76.12,46.56 v77.11,45.57 | v91.82,45.57 93.57,47.32 93.57,54.25 94.03,54.71 v98.83,54.71 | v38.41,79.4 38.41,38.1 R12.2 | v24.08,88.01 24,87.94 24,80.77 24.77,80.01 IC1.6 | v82.07,44.81 81.76,44.5 81.76,39.93 v76.35,34.52 | v70.56,34.75 68.35,32.54 68.35,29.11 66.75,27.51 57.3,27.51 v57.3,28.04 | v46.41,27.96 43.28,27.96 43.28,33.98 v40.69,36.58
CPU_CLK_BFI
  Top 0.254: JP5.8 27.74,2.9 28.8,2.9 JP5.10 | JP5.2 20.12,2.9 21.18,2.9 JP5.4 22.63,2.9 23.7,2.9 JP5.6 25.15,2.9 26.29,2.9 JP5.8 | IC11.1 18.06,10.13 18.75,9.45 21.26,9.45 21.95,10.13 IC11.3 23.16,10.21 23.93,9.45 25.68,9.45 | 25.68,9.45 26.21,9.45 26.98,10.21 IC11.5 | IC11.13 20.65,19.66 21.41,20.42 23.7,20.42 24.46,19.66 IC11.11 25.68,19.66 26.44,20.42 28.8,20.42 29.57,19.66 IC11.9 | JP5.8 26.67,3.58 25.68,4.57 25.68,9.45
  Bottom 0.254: IC11.5 27.89,12.42 29.87,14.4 29.87,17.45 IC11.9
CTC_IEI  (via drill 0.58)
  Top 0.254: v47.4,61.57 49.23,61.57 IC6.13 | v133.12,92.43 135.64,89.92 v137.01,89.92 | v141.35,64.77 141.35,59.82 v142.72,59.82 | v125.81,18.29 125.35,17.83 113.77,17.83 112.7,18.9 112.7,26.52 109.88,26.52 109.12,27.28 91.9,27.28 v91.52,26.9 | v84.2,26.9 v89.69,26.9 | v80.7,26.9 78.79,28.8 v66.14,28.8
  Bottom 0.254: v47.4,61.57 47.4,48.69 46.63,47.93 RN2.5 46.71,46.71 47.4,46.02 47.4,39.32 49.99,36.73 49.99,33.07 64.31,33.07 65.76,31.62 65.76,29.18 v66.14,28.8 | v133.12,92.43 133.12,94.49 130.99,94.49 129.92,95.56 JP20.9 | v137.01,89.92 138.15,88.77 138.15,76.66 141.35,73.46 v141.35,64.77 | v142.72,59.82 143.87,58.67 143.87,51.59 140.66,48.39 140.66,44.88 139.83,44.04 139.83,41 139.6,40.77 139.6,30.48 140.06,30.02 140.06,29.03 136.78,25.76 129.01,25.76 129.01,23.93 125.81,20.73 v125.81,18.29 | v89.69,26.9 v91.52,26.9 | v80.7,26.9 v84.2,26.9
CTC_IEO  (via drill 0.58)
  Top 0.254: v53.34,68.35 53.11,68.35 51.74,66.98 IC6.11 | v57.45,85.65 57.68,85.88 v79.25,85.88 | v82.98,88.24 83.59,88.85 91.59,88.85 93.5,90.75 100.97,90.75 101.5,91.29 v109.88,91.29 | v115.14,91.82 116.43,90.53 126.34,90.53 v126.72,90.14
  Bottom 0.254: v53.34,68.35 53.34,81.53 v57.45,85.65 | v79.25,85.88 82.98,85.88 v82.98,88.24 | v109.88,91.29 110.34,91.75 110.34,94.79 111.94,96.39 113.23,96.39 113.23,95.33 114.3,94.26 114.3,92.66 v115.14,91.82 | v126.72,90.14 127.79,91.21 127.79,94.41 127.03,95.17 JP20.7
CTC_TO0  (via drill 0.58)
  Top 0.254: v55.47,76.5 51.74,76.5 IC6.7 | v115.14,46.18 111.94,42.98 v110.26,42.98 | v94.26,41.22 93.5,41.99 88.24,41.99 87.4,41.15 v85.34,41.15 | v81.23,59.89 80.92,59.59 76.66,59.59 75.97,60.27 73.84,60.27 v73.38,59.82 | v73.46,50.75 73.46,46.02 v70.41,46.02 | v65.68,32.92 65,32.23 v63.63,32.23 | v60.88,32.23 60.05,33.07 v38.79,33.07 | v36.73,54.94 39.24,57.45 39.24,60.05 45.57,60.05 v45.72,59.89
  Bottom 0.254: IC3.13 117.5,55.24 117.5,53.95 IC3.14 116.51,52.73 115.14,51.36 v115.14,46.18 | v55.47,76.5 56.24,76.5 56.24,76.43 56.62,76.05 59.05,76.05 59.05,75.67 JP3.3 | v110.26,42.98 105.54,38.25 105.54,37.95 104.55,36.96 97.99,36.96 97.99,37.49 v94.26,41.22 | v85.34,41.15 83.9,42.6 83.9,57.23 v81.23,59.89 | v73.38,59.82 73.46,59.74 v73.46,50.75 | v70.41,46.02 69.19,44.81 69.19,36.42 v65.68,32.92 | v60.88,32.23 v63.63,32.23 | v38.79,33.07 36.73,35.13 v36.73,54.94 | v45.72,59.89 46.1,60.27 46.1,72.77 49.53,76.2 IC6.7
CTC_TO1  (via drill 0.58)
  Top 0.254: v137.24,67.97 v134.57,65.3 | v137.31,73.91 134.95,76.28 v134.8,76.28 | v119.18,77.19 v128.32,77.19 | v115.44,58.22 115.44,57.68 115.14,57.38 115.14,56.39 113.54,56.39 110.95,58.98 105,58.98 103.56,60.43 v98.53,60.43 | v95.48,60.43 85.72,60.43 84.35,59.05 75.97,59.05 v75.59,59.44 75.36,58.98 69.27,58.98 v68.66,58.37 | v75.51,73.91 74.14,75.29 v64.08,75.29 | v58.06,55.78 58.9,54.94 v62.1,54.94
  Bottom 0.254: v134.57,65.3 134.57,65 132.06,65 131.06,64.01 131.06,54.63 131.75,53.95 IC3.27 | v137.24,67.97 137.31,68.05 v137.31,73.91 | v134.8,76.28 133.88,77.19 v128.32,77.19 | v119.18,77.19 119.18,60.5 118.11,59.44 115.44,59.44 v115.44,58.22 | v95.48,60.43 v98.53,60.43 | v75.59,59.44 75.51,59.51 v75.51,73.91 | v64.08,75.29 59.66,70.87 59.66,70.56 JP3.7 | v58.06,55.78 55.7,58.14 55.7,63.48 52.5,66.67 52.5,72.62 51.44,73.69 IC6.8 | v62.1,54.94 62.48,55.32 62.48,55.4 63.7,56.62 68.66,56.62 v68.66,58.37
CTC_TO2  (via drill 0.58)
  Top 0.254: v54.18,70.03 53.19,70.03 51.74,71.48 IC6.9
  Bottom 0.254: v54.18,70.03 55.7,68.5 55.7,66.83 56.62,65.91 57.91,65.91 57.91,65.84 58.67,65.08 JP3.11
CTC_TRG0
  Top 0.254: IC6.23 66.98,79.4 68.89,79.4 RN5.2
  Bottom 0.254: JP3.1 60.12,77.72 63.78,77.72 63.78,77.8 64.77,78.79 IC6.23
CTC_TRG1
  Top 0.254: IC6.22 66.98,76.89 68.89,76.89 RN5.3
  Bottom 0.254: JP3.5 60.12,72.69 64.47,77.04 IC6.22
CTC_TRG2
  Top 0.254: IC6.21 RN5.4
  Bottom 0.254: JP3.9 59.66,68.05 64.77,73.15 64.77,73.69 IC6.21
CTC_TRG3
  Top 0.254: IC6.20 66.98,71.78 68.89,71.78 RN5.5
  Bottom 0.254: JP3.13 59.66,62.94 60.5,63.78 60.5,65.23 59.51,66.22 58.29,66.22 58.29,66.75 58.22,66.83 58.22,72.85 59.21,73.84 60.58,73.84 64.62,77.88 67.44,77.88 67.44,73.15 66.67,72.39 IC6.20
CTS_A  (via drill 0.58)
  Top 0.254: v153.77,45.19 153.39,45.57 139.98,45.57 v139.6,45.95 | v138.99,42.67 138.46,42.14 v130.91,42.14 | v128.17,44.88 126.72,43.43 118.72,43.43 IC3.18
  Bottom 0.254: v153.77,45.19 153.77,42.75 155.6,40.92 IC8.8 | v139.6,45.95 138.99,45.34 v138.99,42.67 | v128.17,44.88 v130.91,42.14
CTS_A_BFI
  Bottom 0.254: IC8.10 150.5,40.92 149.12,42.29 149.12,45.95 JP2.6
CTS_B  (via drill 0.58)
  Top 0.254: v151.49,60.58 150.34,59.44 150.04,59.44 v146.61,56.01 | v141.28,44.27 140.51,43.51 133.96,43.51 IC3.23
  Bottom 0.254: v151.49,60.58 151.49,62.79 154.08,65.38 154.08,74.37 155.3,75.59 IC10.8 | v146.61,56.01 146.46,55.85 146.46,53.49 141.28,48.31 v141.28,44.27
CTS_B_BFI
  Bottom 0.254: IC10.10 150.19,78.11 148.82,79.48 148.82,82.75 JP7.6
D0  (via drill 0.58)
  Top 0.254: v20.04,34.14 19.2,33.3 v13.34,33.3 | v90.91,47.24 88.47,47.24 88.24,47.02 IC2.19 | v94.64,76.89 93.04,78.49 83.97,78.49 v81.99,80.47 | v79.02,80.85 76.89,80.85 74.22,78.18 64.77,78.18 v63.7,79.25 | v138.99,80.39 133.66,85.72 IC3.40 | v145.54,64.24 146.91,62.87 v146.91,60.27 | v155.68,20.8 155.3,21.18 138.07,21.18 134.95,24.31 v133.81,24.31 | v111.18,28.19 93.65,28.19 v90.91,30.94 | v24,60.66 24.16,60.5 30.79,60.5 35.51,65.23 43.74,65.23 v44.35,65.84 | v48.46,79.48 49.53,80.54 v54.18,80.54 | v58.37,84.12 64.47,84.12 IC6.25
  Bottom 0.254: v20.04,34.14 23.55,37.64 23.55,57.23 24.77,58.45 IC1.14 24.77,59.66 24,60.43 v24,60.66 | v13.34,33.3 8.61,38.02 JP6.2 | v94.64,76.89 94.64,59.21 93.12,57.68 93.12,49.45 v90.91,47.24 90.98,46.79 90.98,37.41 90.75,37.19 90.75,31.09 v90.91,30.94 | v81.99,80.47 81.46,80.47 81.08,80.85 v79.02,80.85 | v63.7,79.25 64.01,79.55 64.01,79.78 65.15,80.92 67.44,80.92 67.44,83.06 66.67,83.82 IC6.25 | v138.99,80.39 141.88,77.5 141.88,67.89 v145.54,64.24 | v146.91,60.27 152.02,55.17 152.02,52.81 155.6,49.23 155.6,44.81 156.97,43.43 156.97,22.1 v155.68,20.8 | v133.81,24.31 133.43,24.31 132.36,23.24 129.01,23.24 129.01,20.27 126.19,17.45 122.45,17.45 122.45,25.22 123.52,26.29 125.81,26.29 125.81,27.81 125.27,28.35 111.18,28.35 v111.18,28.19 | v44.35,65.84 43.97,66.22 43.97,74.98 v48.46,79.48 | v54.18,80.54 54.86,81.23 54.86,82.37 56.62,84.12 v58.37,84.12
D0K  (via drill 0.58)
  Top 0.254: v90.6,15.24 v93.27,17.91
  Bottom 0.254: v90.6,15.24 89.46,14.1 89.46,12.57 89.61,12.42 89.61,11.28 89.46,11.12 89.46,8.61 89.53,8.53 D0.K | v93.27,17.91 93.65,17.91 93.65,22.17 94.34,22.86 R20.2
D1  (via drill 0.58)
  Top 0.254: v89.23,33.83 94.41,28.65 108.58,28.65 v112.7,32.77 | v20.04,55.85 24.08,55.85 24.46,56.24 IC1.15 | v12.8,39.85 11.96,40.69 8.69,40.69 JP6.4 | v59.59,88.09 63.7,88.09 64.47,87.33 IC6.26 | v52.27,94.94 51.74,95.48 26.75,95.48 v23.09,91.82 | v78.64,15.24 77.8,14.4 52.35,14.4 47.09,19.66 47.09,21.18 41.76,21.18 38.56,24.38 v38.56,28.12 | v33.91,39.93 33.83,39.85 v18.29,39.85
  Bottom 0.254: v112.7,32.77 120.85,32.77 120.85,55.47 121.23,55.85 121.23,63.09 120.02,64.31 120.02,84.12 118.42,85.72 IC3.1 | IC2.20 86.33,43.51 86.33,36.73 v89.23,33.83 89,33.38 88.85,33.22 88.85,21.64 84.12,16.92 78.64,16.92 v78.64,15.24 | 17.83,40.31 17.37,39.85 v12.8,39.85 | 17.83,40.31 17.98,40.46 17.98,46.1 20.19,48.31 20.19,55.7 v20.04,55.85 19.81,56.31 19.2,56.92 19.2,66.75 20.5,68.05 20.5,89.23 v23.09,91.82 | v59.59,88.09 59.28,88.39 59.28,94.34 58.67,94.94 v52.27,94.94 | v38.56,28.12 36.27,30.4 36.27,34.21 33.91,36.58 v33.91,39.93 | 17.83,40.31 v18.29,39.85
D1K  (via drill 0.58)
  Top 0.254: v89.92,22.86 90.3,23.24 91.14,23.24 R21.2
  Bottom 0.254: v89.92,22.86 89.92,22.02 86.56,18.67 86.56,9.68 85.42,8.53 D1.K
D2  (via drill 0.58)
  Top 0.254: v21.79,64.08 24.46,64.08 IC1.12 26.98,64.47 27.89,65.38 v32.16,65.38 | v15.62,42.22 v20.5,42.22 | v12.8,42.22 11.81,43.2 8.69,43.2 JP6.6 | v127.94,90.14 127.1,90.98 119.79,90.98 v115.06,95.71 | v107.82,96.77 107.52,97.08 86.49,97.08 v86.18,96.77 | v34.98,93.95 35.13,93.8 v54.48,93.8 | v58.45,89.92 58.52,89.84 64.47,89.84 IC6.27
  Bottom 0.254: v21.79,64.08 21.79,43.51 v20.5,42.22 | v12.8,42.22 v15.62,42.22 | 86.11,96.77 86.11,93.04 IC2.1 | 86.11,96.77 86.11,97 77.57,97 74.52,93.95 74.52,92.81 69.49,92.81 66.75,90.07 IC6.27 | v127.94,90.14 127.94,88.24 131.75,84.43 IC3.39 | v115.06,95.71 114.15,96.62 114.15,96.85 113.69,97.31 107.82,97.31 v107.82,96.77 | 86.11,96.77 v86.18,96.77 | v32.16,65.38 31.77,65.76 31.77,90.75 v34.98,93.95 | v54.48,93.8 55.02,93.8 55.7,94.49 58.45,94.49 v58.45,89.92
D3  (via drill 0.58)
  Top 0.254: v114.38,84.89 115.44,84.89 116.2,84.12 IC3.2 | v44.81,73.3 27.66,73.3 26.98,73.99 IC1.8 | v48.46,76.96 49.68,78.18 v55.47,78.18 | v6.78,72.39 6.93,72.54 v12.19,72.54 | v19.13,75.13 21.64,77.65 v23.93,77.65 | v84.2,91.21 100.05,91.21 100.97,92.13 IC2.40
  Bottom 0.254: v114.38,84.89 112.55,86.72 112.55,87.86 111.71,88.7 103.94,88.7 103.94,90.98 103.17,91.75 IC2.40 | v44.81,73.3 v48.46,76.96 | v55.47,78.18 55.93,78.18 58.22,80.47 64.01,80.47 64.01,88.54 | 64.01,88.54 64.01,90.68 64.77,91.44 IC6.28 | v6.78,72.39 6.78,70.33 5.26,70.33 4.27,69.34 4.27,49.99 5.64,49.99 6.55,49.07 6.55,47.85 7.62,46.79 JP6.8 | v12.19,72.54 17.14,72.54 17.14,72.69 19.13,74.68 v19.13,75.13 | v23.93,77.65 24,77.57 24,75.67 24.77,74.91 IC1.8 | v84.2,91.21 81.92,93.5 74.98,93.5 74.98,92.58 73.84,91.44 68.81,91.44 68.81,90.91 67.44,89.53 67.44,89.15 66.83,88.54 64.01,88.54
D4  (via drill 0.58)
  Top 0.254: v128.25,81.53 120.09,89.69 v117.58,89.69 | v115.14,94.41 v116.81,92.73 | 33.07,77.72 36.8,77.72 37.19,78.11 v42.29,78.11 | 33.07,77.72 27.58,77.72 26.98,77.11 IC1.7 | v46.25,91.75 49.23,91.75 IC6.1 | v12.8,35.13 13.64,34.29 15.16,34.29 16.69,35.81 30.4,35.81 v30.71,35.51 | v33.07,77.65 33.07,77.72 | v84.2,94.79 v94.72,94.79 | v81.15,96.16 80.7,96.62 v57.23,96.62
  Bottom 0.254: v128.25,81.53 131.44,81.53 IC3.38 | v117.58,89.69 116.81,90.45 v116.81,92.73 | v115.14,94.41 113.69,95.86 113.69,96.62 113.46,96.85 109.12,96.85 109.12,96.39 106.15,93.42 100.58,93.42 | 100.58,93.42 100.58,91.14 101.27,90.45 IC2.39 | v42.29,78.11 46.25,82.07 v46.25,91.75 | v12.8,35.13 9.22,38.71 9.22,46.86 8.23,47.85 JP6.10 | v30.71,35.51 33.07,37.87 33.07,56.84 33.45,57.23 33.45,77.27 v33.07,77.65 | v94.72,94.79 94.72,93.5 100.51,93.5 100.58,93.42 | v84.2,94.79 82.53,94.79 v81.15,96.16 | v57.23,96.62 51.44,96.62 51.44,92.66 IC6.1
D4A
  Bottom 0.254: D4.A 140.66,3.12 144.4,6.86 144.4,8.76 145.16,9.53 R15.1
D5  (via drill 0.58)
  Top 0.254: v114,81.61 116.13,81.61 116.2,81.53 IC3.3 | v110.03,85.72 109.58,86.18 104.32,86.18 103.48,87.02 IC2.38 100.97,87.63 99.52,89.08 v93.04,89.08 | v28.27,72.47 27.36,72.47 26.98,72.08 IC1.9 | v28.57,88.09 29.03,88.54 48.54,88.54 49.23,89.23 IC6.2 | v74.83,95.78 74.37,95.33 v66.83,95.33 | v63.09,91.59 62.71,91.21 v57.23,91.21
  Bottom 0.254: v114,81.61 111.94,83.67 110.8,83.67 110.8,83.74 110.03,84.51 v110.03,85.72 | v28.27,72.47 28.57,72.77 v28.57,88.09 28.57,96.77 15.93,96.77 10.67,91.52 10.67,90.45 10.06,90.45 6.78,87.17 6.78,75.36 8.15,75.36 9.07,74.45 9.07,52.58 8.31,51.82 JP6.12 | v93.04,89.08 92.43,89.69 92.43,94.34 89.15,97.61 74.83,97.61 v74.83,95.78 | v63.09,91.59 v66.83,95.33 | v57.23,91.21 56.39,90.37 51.44,90.37 51.44,90.14 IC6.2
D5A
  Top 0.254: R18.1 131.14,3.28 131.6,2.82 134.65,2.82 D5.A
D6  (via drill 0.58)
  Top 0.254: v17.91,69.95 24,69.95 24.46,69.49 IC1.10 26.98,69.49 27.05,69.49 v29.11,71.55 | JP6.14 v12.19,57.91 | v29.41,87.17 30.25,88.01 48.54,88.01 49.23,87.33 IC6.3 51.74,87.33 53.11,87.33 v54.48,88.7 | v82.14,87.33 85.72,87.33 IC2.3 88.24,87.02 88.62,86.64 93.12,86.64 v93.88,87.4 | v74.22,88.47 74.07,88.32 64.16,88.32 63.55,88.92 57.45,88.92 v57.23,88.7 | v128.32,79.02 120.85,86.49 v119.56,86.49
  Bottom 0.254: v17.91,69.95 17.98,69.88 17.98,63.32 17.07,62.41 16.38,62.41 15.39,61.42 15.39,60.73 14.55,59.89 13.03,59.89 13.03,58.75 v12.19,57.91 | v29.41,87.17 29.11,86.87 v29.11,71.55 | v82.14,87.33 81.76,87.71 81.76,87.78 81.08,88.47 v74.22,88.47 | v54.48,88.7 v57.23,88.7 | v128.32,79.02 131.44,79.02 IC3.37 | v119.56,86.49 115.98,90.07 115.98,96.01 113.69,98.3 106.98,98.3 106.98,95.86 106.53,95.4 95.56,95.4 95.56,95.86 95.1,96.32 93.88,96.32 v93.88,87.4
D6A
  Top 0.254: D6.K 145.47,5.71 145.47,7.01 R19.1
D7  (via drill 0.58)
  Top 0.254: v111.25,94.49 110.72,93.95 v91.59,93.95 | 20.95,62.56 15.93,62.56 v15.62,62.87 | 20.95,62.56 23.77,62.56 24.46,61.87 IC1.13 | v12.19,59.13 9.53,56.46 8.69,56.46 JP6.16 | v22.71,82.07 23.55,82.91 31.24,82.91 33.83,85.5 48.46,85.5 49.23,84.73 IC6.4 | 20.95,62.56 v20.95,62.48 | v76.2,94.41 76.12,94.49 v64.77,94.49
  Bottom 0.254: v111.25,94.49 112.7,94.49 113.16,94.03 113.16,90.07 115.21,88.01 115.21,83.97 116.13,83.06 116.13,82.07 115.82,81.76 115.82,80.01 116.51,79.32 IC3.4 | v91.59,93.95 88.01,90.37 IC2.2 86.03,90.45 85.04,91.44 85.04,91.59 82.22,94.41 v76.2,94.41 | v15.62,62.87 14.94,62.87 14.94,62.79 14.55,62.41 12.5,62.41 12.5,59.44 v12.19,59.13 | v22.71,82.07 22.63,81.99 22.63,67.21 20.95,65.53 v20.95,62.48 | v64.77,94.49 61.95,91.67 61.95,81.46 61.42,80.92 59.21,80.92 59.21,85.11 57.84,86.49 54.1,86.49 54.1,84.73 53.65,84.28 51.74,84.28 IC6.4
DCD_A  (via drill 0.58)
  Top 0.254: v132.74,33.3 133.2,33.76 151.94,33.76 152.71,32.99 IC8.6 | v127.64,39.01 126.26,40.39 118.72,40.39 IC3.19
  Bottom 0.254: v132.74,33.3 127.64,38.41 v127.64,39.01
DCD_A_BFI  (via drill 0.58)
  Top 0.254: v147.14,36.12 144.25,39.01 144.25,42.06 v143.41,42.06
  Bottom 0.254: v147.14,36.12 147.14,34.14 147.98,33.3 IC8.4 | v143.41,42.06 142.72,42.75 142.72,47.62 143.56,48.46 JP2.1
DCD_B  (via drill 0.58)
  Top 0.254: v148.67,66.83 150.95,66.83 152.4,68.28 IC10.6 | v138.53,41.3 138.15,40.92 133.96,40.92 IC3.22
  Bottom 0.254: v148.67,66.83 146.46,64.62 146.46,61.11 145.92,60.58 143.87,60.58 143.87,63.32 143.26,63.93 141.35,63.93 141.35,51.28 138.15,48.08 138.15,41.68 v138.53,41.3
DCD_B_BFI
  Bottom 0.254: IC10.4 147.68,70.48 146.91,71.25 146.91,82.45 147.52,83.06 147.52,86.49 146.84,87.17 144.09,87.17 144.09,86.79 JP7.1
DTR_A  (via drill 0.58)
  Top 0.254: IC7.13 IC7.12 | v122.15,46.94 119.71,46.94 118.72,47.93 IC3.16 | v129.16,32.77 135.79,26.14 v139.9,26.14
  Bottom 0.254: v122.15,46.94 122.99,46.1 122.99,38.94 v129.16,32.77 | v139.9,26.14 142.26,23.77 IC7.13
DTR_A_BFD  (via drill 0.58)
  Top 0.254: v156.44,45.87 154.23,48.08 153.01,48.08 152.17,48.92 JP2.7
  Bottom 0.254: v156.44,45.87 158.8,43.51 158.8,22.02 154.53,17.75 154.53,13.56 152.55,13.56 152.02,14.1 152.02,15.85 149.5,18.36 149.5,20.27 148.21,21.57 IC7.11
DTR_B  (via drill 0.58)
  Top 0.254: IC9.13 143.49,62.26 144.78,62.26 IC9.12 | v139.83,48.54 133.96,48.54 IC3.25
  Bottom 0.254: v139.83,48.54 141.88,50.6 141.88,60.27 142.57,60.96 IC9.13
DTR_B_BFD  (via drill 0.58)
  Top 0.254: v153.24,74.37 153.69,74.83 v155.75,74.83